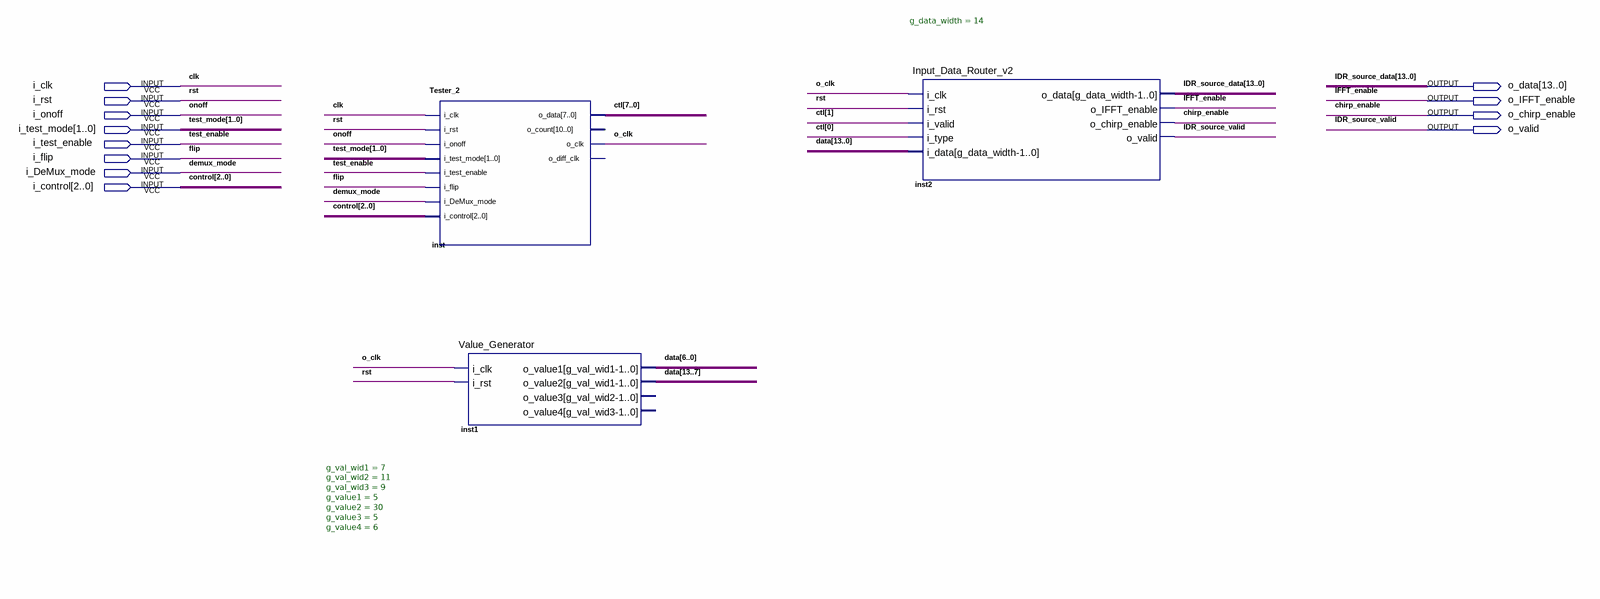
[diagram p0: schematic sheet]
// Quartus schematic Input_Data_Router_Test.bdf as structural Verilog: 3 symbols, 12 pins
module Input_Data_Router_Test (
  input  i_clk,
  input  i_rst,
  input  i_onoff,
  input  [1:0] i_test_mode,
  input  i_test_enable,
  input  i_flip,
  input  i_DeMux_mode,
  input  [2:0] i_control,
  output [13:0] o_data,
  output o_IFFT_enable,
  output o_chirp_enable,
  output o_valid
);

  wire o_clk;
  wire [7:0] ctl;
  wire [13:0] data;

  Tester_2 inst (
    .i_clk(i_clk), .i_rst(i_rst), .i_onoff(i_onoff), .i_test_mode(i_test_mode),
    .i_test_enable(i_test_enable), .i_flip(i_flip), .i_DeMux_mode(i_DeMux_mode), .i_control(i_control),
    .o_data(ctl), .o_clk(o_clk));  // open: o_count, o_diff_clk
  Value_Generator #(.g_val_wid1(7), .g_val_wid2(11), .g_val_wid3(9), .g_value1(5), .g_value2(30), .g_value3(5), .g_value4(6)) inst1 (
    .i_clk(o_clk), .i_rst(i_rst), .o_value1(data[6:0]), .o_value2(data[13:7]));  // open: o_value3, o_value4
  Input_Data_Router_v2 #(.g_data_width(14)) inst2 (
    .i_clk(o_clk), .i_rst(i_rst), .i_valid(ctl[1]), .i_type(ctl[0]), .i_data(data), .o_data(o_data),
    .o_IFFT_enable(o_IFFT_enable), .o_chirp_enable(o_chirp_enable), .o_valid(o_valid));

  // Other names for the same wires on the sheet: chirp_enable = o_chirp_enable; clk = i_clk; control[2:0] = i_control;
  //   demux_mode = i_DeMux_mode; flip = i_flip; IDR_source_data[13:0] = o_data; IDR_source_valid = o_valid;
  //   IFFT_enable = o_IFFT_enable; onoff = i_onoff; rst = i_rst; test_enable = i_test_enable;
  //   test_mode[1:0] = i_test_mode
endmodule
